# Altium schematic sheet Connectors.SchDoc
size A4; SheetNumber: 6; SheetTotal: 6
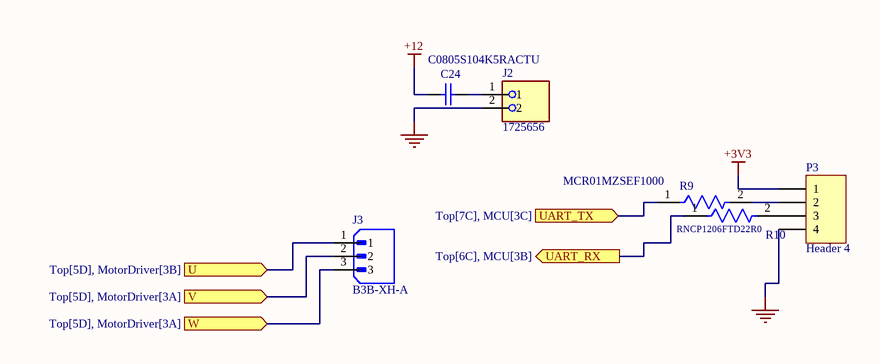
[diagram p0: Connectors.SchDoc]

## Parts
C24  C0805S104K5RACTU  [CAPC2013X145X50NL20T25]
J2  1725656  [PHOENIX_1725656]
J3  B3B-XH-A  [JST_B3B-XH-A]
P3  Header 4  [HDR1X4]
R9  MCR01MZSEF1000  [FP-MCR01-MFG]
R10  RNCP1206FTD22R0  [FP-RNCP1206-MFG]

## Ports
U (in, see Top[5D], MotorDriver[3B]), UART_RX (out, see Top[6C], MCU[3B]), UART_TX (in, see Top[7C], MCU[3C]), V (in, see Top[5D], MotorDriver[3A]), W (in, see Top[5D], MotorDriver[3A])

## Nets
+3V3: P3.1
+12: C24.1
NetJ2_2: J2.2 P3.4
U: J3.1 ; port U
UART_RX: R10.1 ; port UART_RX
UART_TX: R9.1 ; port UART_TX
V: J3.2 ; port V
W: J3.3 ; port W
NetC24_2: C24.2 J2.1
NetP3_2: P3.2 R9.2
NetP3_3: P3.3 R10.2

## Library data of the parts
C24 = CMP-2007-01227-1: Manufacturer: Kemet; Part Number: C0805S104K5RACTU
J2 = 1725656: PCB Terminal Screw 2.54mm 20AWG 160V 6A 2 Position COMBICON MPT Series | Phoenix Contact 1725656; SnapEDA_Link: https://www.snapeda.com/parts/1725656/Phoenix+Contact/view-part/?ref=snap; Package: None; Value: *; MF: Phoenix Contact; MP: 1725656; Check_prices: https://www.snapeda.com/parts/1725656/Phoenix+Contact/view-part/?ref=eda
J3 = B3B-XH-A: Connector Header Through Hole 3 position 0.098 (2.50mm); MF: JST Sales; SnapEDA_Link: https://www.snapeda.com/parts/B3B-XH-A/JST/view-part/?ref=snap; Package: None; Value: *; MP: B3B-XH-A; Check_prices: https://www.snapeda.com/parts/B3B-XH-A/JST/view-part/?ref=eda
P3 = Header 4: Header, 4-Pin; LatestRevisionDate: 17-Jul-2002; LatestRevisionNote: Re-released for DXP Platform.; Publisher: Altium Limited
R9 = CMP-08839-014919-1: Thick Film Chip Resistor, 0402, 100Ω, 1%, 100ppm/°C, 0.063W, 50V
R10 = CMP-26527-002781-1: 22Ω ±1% 0.5W 1206 High Power Anti-Sulfur Thin Film Chip Resistor; Tolerance: 1%; RoHS Compliant: Yes; Mount: Surface Mount; Max Operating Temperature: 155°C; Min Operating Temperature: -55°C